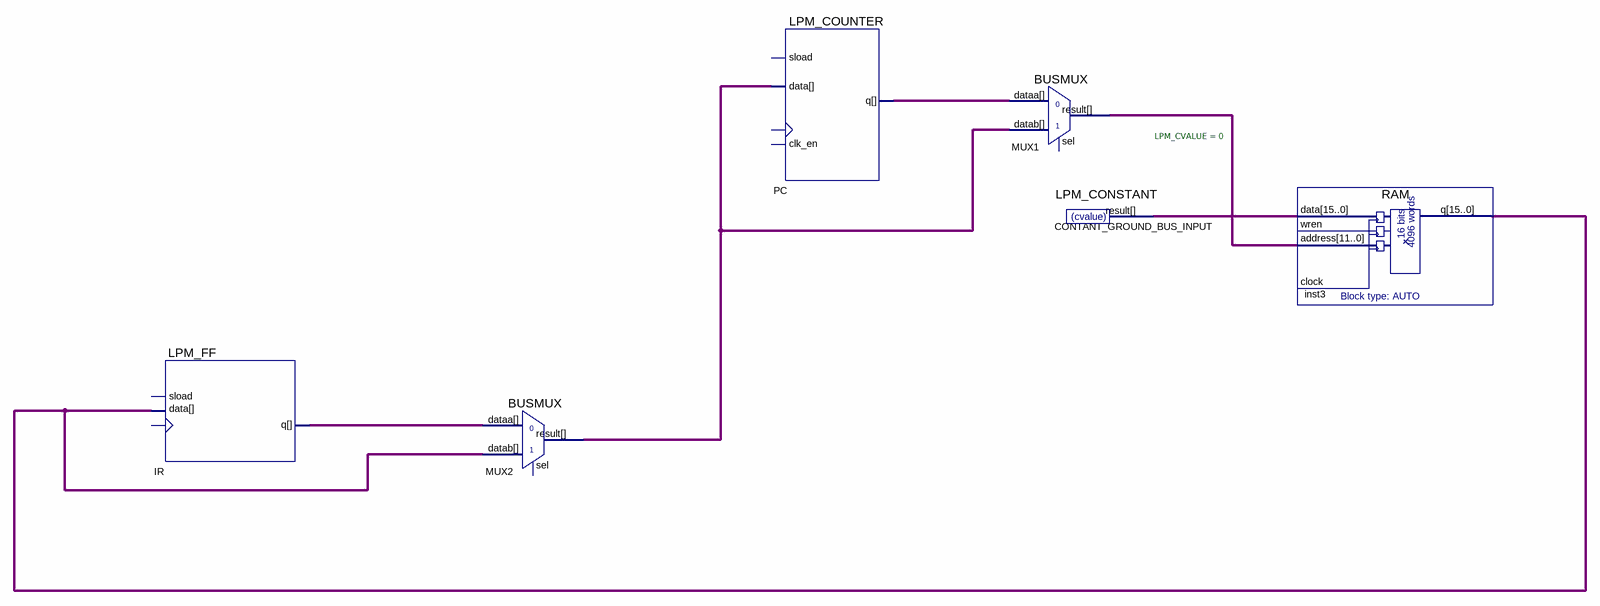
[diagram p0: schematic sheet]
// Quartus schematic TASK1.bdf as structural Verilog: 6 symbols, 0 pins
module TASK1 (
);

  wire IR_q, MUX2_result, PC_q;
  wire [11:0] MUX1_result;
  wire [15:0] CONTANT_GROUND_BUS_INPUT_result, inst3_q;

  LPM_FF IR (.data(inst3_q), .q(IR_q));  // open: clock, sload
  BUSMUX MUX2 (.datab(inst3_q), .dataa(IR_q), .result(MUX2_result));  // open: sel
  LPM_COUNTER PC (.data(MUX2_result), .q(PC_q));  // open: clk_en, clock, sload
  BUSMUX MUX1 (.datab(MUX2_result), .dataa(PC_q), .result(MUX1_result));  // open: sel
  LPM_CONSTANT #(.LPM_CVALUE(0)) CONTANT_GROUND_BUS_INPUT (.result(CONTANT_GROUND_BUS_INPUT_result));
  RAM inst3 (.data(CONTANT_GROUND_BUS_INPUT_result), .address(MUX1_result), .q(inst3_q));  // open: wren, clock
endmodule
